# Altium project Master.PrjPCB
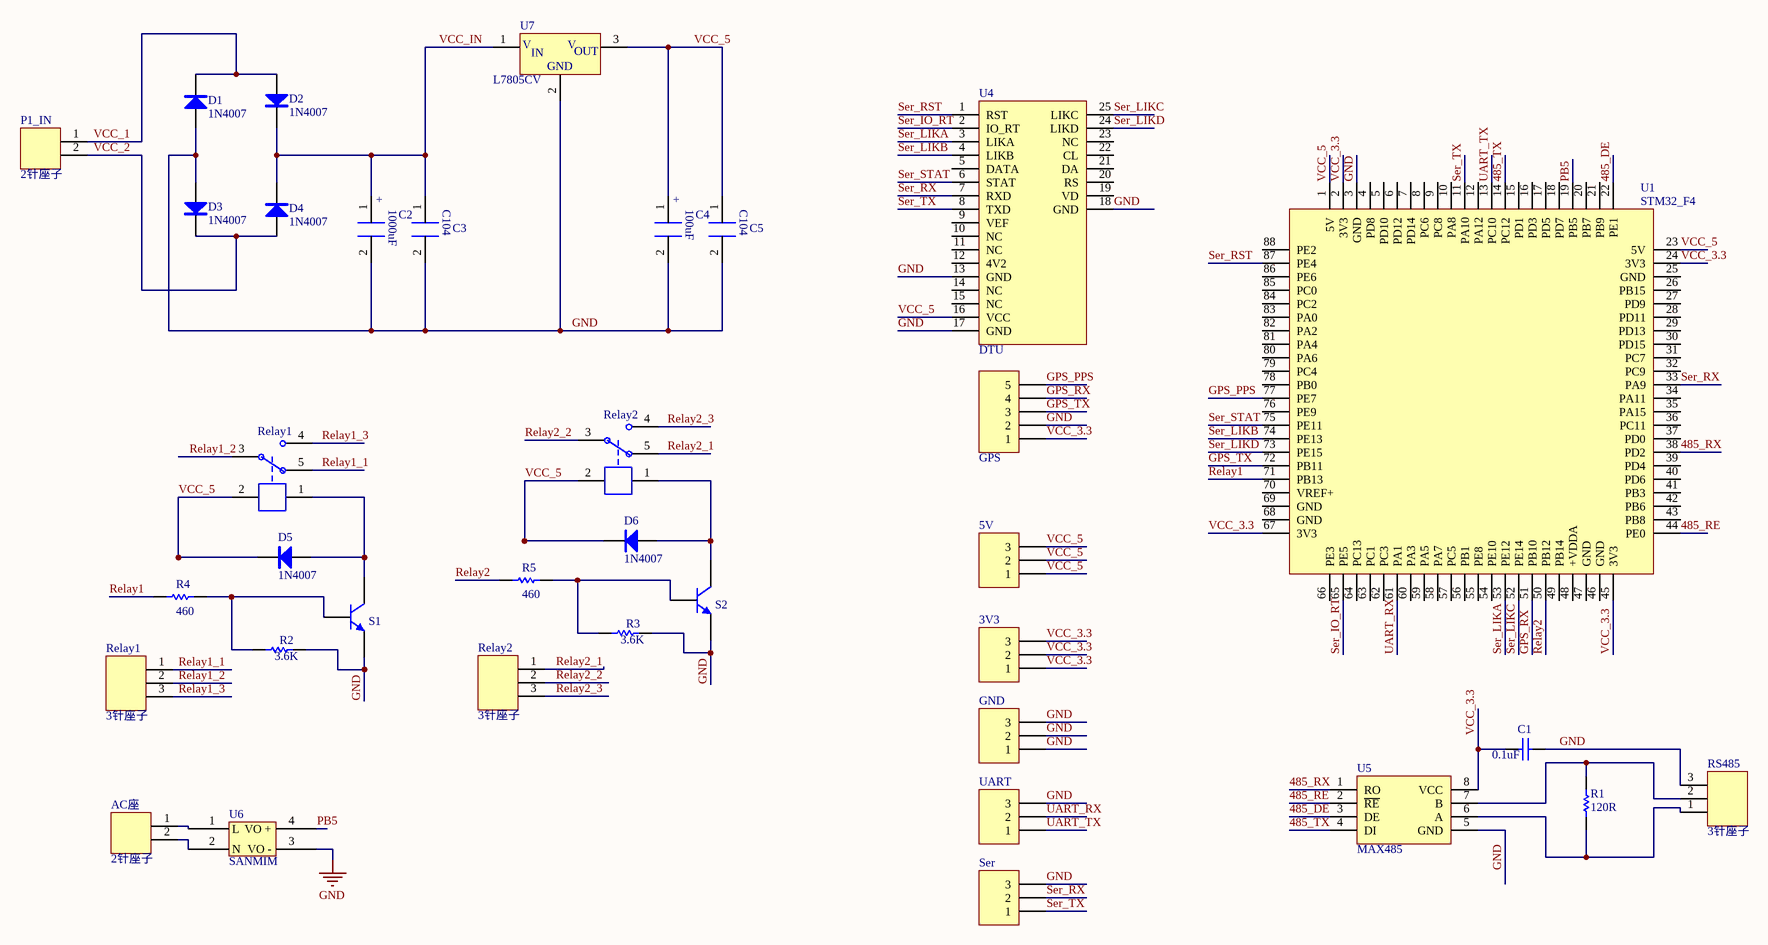
[diagram p0: Master_Sch.SchDoc]
1 sheet, 36 parts. Net scope: global (net labels, ports and power ports of the same name join across sheets).
Board file: Master_Pcb.PcbDoc

## Sheet Master_Sch.SchDoc
size A3; Organization: Altium Limited; Address1: L3, 12a Rodborough Rd; Address2: Frenchs Forest; Address3: NSW; Address4: Australia 2086

### Parts
(Parts that share a designator on the sheet are numbered #1, #2 ... from top to bottom, then left to right.)
3V3  Header 3  [HDR1X3]  (value not drawn)
5V  Header 3  [HDR1X3]  (value not drawn)
AC座  2针座子  [2针座子]
C1  value 0.1uF  [C2012]  (hidden comment: Cap)
C2  Cap1000uF  [Cap1000uF]  (value not drawn)
C3  Cap104  [Cap104]  (value not drawn)
C4  Cap100uF  [Cap100uF]  (value not drawn)
C5  Cap104  [Cap104]  (value not drawn)
D1  1N4007  [1N4007]
D2  1N4007  [1N4007]
D3  1N4007  [1N4007]
D4  1N4007  [1N4007]
D5  1N4007  [1N4007]
D6  1N4007  [1N4007]
GND  Header 3  [HDR1X3]  (value not drawn)
GPS  Header 5  [HDR1X5]  (value not drawn)
P1_IN  2针座子  [2针座子]
R1  value 120R  [R2012]  (hidden comment: Res)
R2  value 3.6K  [AXIAL-0.3]  (hidden comment: Res1)
R3  value 3.6K  [AXIAL-0.3]  (hidden comment: Res1)
R4  value 460  [AXIAL-0.3]  (hidden comment: Res1)
R5  value 460  [AXIAL-0.3]  (hidden comment: Res1)
Relay1#1  Relay_single  [Relay_single]  (value not drawn)
Relay1#2  3针座子  [3针座子]
Relay2#1  Relay_single  [Relay_single]  (value not drawn)
Relay2#2  3针座子  [3针座子]
RS485  3针座子  [3针座子]
S1  S9013_NPN  [S9013_NPN]  (value not drawn)
S2  S9013_NPN  [S9013_NPN]  (value not drawn)
Ser  Header 3  [HDR1X3]  (value not drawn)
U1  STM32_F4  [STM32_F4]
U4  DTU  [DTU]
U5  MAX485  [SOP8]
U6  SANMIM  [2针宽座子]
U7  L7805CV  [L7805CV]
UART  Header 3  [HDR1X3]  (value not drawn)

### Nets
GND: C1.2 C2.2 C3.2 C4.2 C5.2 D1.1(A) D3.1(A) GND.1 GND.2 GND.3 GPS.2 R2.2 R3.2 RS485.3 S1.3(C) S2.3(C) Ser.3 U1.3(GND) U4.13(GND) U4.17(GND) U4.18(GND) U5.5(GND) U6.3(VO_-) U7.2(GND) UART.3
485_DE: U1.22(PE1) U5.3(DE)
485_RE: U1.44(PE0) U5.2(~{RE})
485_RX: U1.38(PD2) U5.1(RO)
485_TX: U1.14(PC12) U5.4(DI)
GPS_PPS: GPS.5 U1.77(PE7)
GPS_RX: GPS.4 U1.51(PB10)
GPS_TX: GPS.3 U1.72(PB11)
PB5: U1.19(PB5) U6.4(VO_+)
Relay1: R4.1 U1.71(PB13)
Relay1_1: Relay1#1.5 Relay1#2.1
Relay1_2: Relay1#1.3 Relay1#2.2
Relay1_3: Relay1#1.4 Relay1#2.3
Relay2: R5.1 U1.50(PB12)
Relay2_1: Relay2#1.5 Relay2#2.1
Relay2_2: Relay2#1.3 Relay2#2.2
Relay2_3: Relay2#1.4 Relay2#2.3
Ser_IO_RT: U1.65(PE5) U4.2(IO_RT)
Ser_LIKA: U1.53(PE12) U4.3(LIKA)
Ser_LIKB: U1.74(PE13) U4.4(LIKB)
Ser_LIKC: U1.52(PE14) U4.25(LIKC)
Ser_LIKD: U1.73(PE15) U4.24(LIKD)
Ser_RST: U1.87(PE4) U4.1(RST)
Ser_RX: Ser.2 U1.33(PA9) U4.7(RXD)
Ser_STAT: U1.75(PE11) U4.6(STAT)
Ser_TX: Ser.1 U1.11(PA10) U4.8(TXD)
UART_RX: U1.61(PA1) UART.2
UART_TX: U1.13(PC10) UART.1
VCC_1: D1.2(K) D2.1(A) P1_IN.1
VCC_2: D3.2(K) D4.1(A) P1_IN.2
VCC_3.3: 3V3.1 3V3.2 3V3.3 C1.1 GPS.1 U1.2(3V3) U1.24(3V3) U1.45(3V3) U1.67(3V3) U5.8(VCC)
VCC_5: 5V.1 5V.2 5V.3 C4.1 C5.1 D5.2(K) D6.2(K) Relay1#1.2 Relay2#1.2 U1.1(5V) U1.23(5V) U4.16(VCC) U7.3(VOUT)
VCC_IN: C2.1 C3.1 D2.2(K) D4.2(K) U7.1(VIN)
NetAC座_1: AC座.1 U6.1(L)
NetAC座_2: AC座.2 U6.2(N)
NetD5_1: D5.1(A) Relay1#1.1 S1.1(E)
NetD6_1: D6.1(A) Relay2#1.1 S2.1(E)
NetR1_1: R1.1 RS485.1 U5.6(A)
NetR1_2: R1.2 RS485.2 U5.7(B)
NetR2_1: R2.1 R4.2 S1.2(B)
NetR3_1: R3.1 R5.2 S2.2(B)

Not connected (* = marked no-connect by the designer): U1 4(PD8) 5(PD10) 6(PD12) 7(PD14) 8(PC6) 9(PC8) 10(PA8) 12(PA12) 15(PD1) 16(PD3) 17(PD5) 18(PD7) 20(PB7) 21(PB9) 25(GND) 26(PB15) 27(PD9) 28(PD11) 29(PD13) 30(PD15) 31(PC7) 32(PC9) 34(PA11) 35(PA15) 36(PC11) 37(PD0) 39(PD4) 40(PD6) 41(PB3) 42(PB6) 43(PB8) 46(GND) 47(GND) 48(+VDDA) 49(PB14) 54(PE10) 55(PE8) 56(PB1) 57(PC5) 58(PA7) 59(PA5) 60(PA3) 62(PC3) 63(PC1) 64(PC13) 66(PE3) 68(GND) 69(GND) 70(VREF+) 76(PE9) 78(PB0) 79(PC4) 80(PA6) 81(PA4) 82(PA2) 83(PA0) 84(PC2) 85(PC0) 86(PE6) 88(PE2); U4 5(DATA) 9(VEF) 10(NC) 11(NC) 12(4V2) 14(NC) 15(NC) 19(VD) 20(RS) 21(DA) 22(CL) 23(NC)

### Notes on the sheet
- Title
- Size:
- Date:
- A4
- Number:
- Time:
- Revision:
- Sheet
- of
- File:
- (in symbol Cap100uF) +; 100uF
- (in symbol Cap104) C104
- (in symbol Cap1000uF) +; 1000uF
- (in symbol L7805CV) V; IN; OUT

### Library data of the parts
3V3 5V GND Ser UART = Header 3: Header, 3-Pin; LatestRevisionDate: 17-Jul-2002; LatestRevisionNote: Re-released for DXP Platform.; Publisher: Altium Limited
C1 = Cap: 贴片电容; Published: 8-Jun-2000; LatestRevisionDate: 17-Jul-2002; LatestRevisionNote: Re-released for DXP Platform.; PackageReference: RAD-0.3; Publisher: Altium Limited
GPS = Header 5: Header, 5-Pin; LatestRevisionDate: 17-Jul-2002; LatestRevisionNote: Re-released for DXP Platform.; Publisher: Altium Limited
R1 = Res: 贴片电阻; Published: 8-Jun-2000; LatestRevisionDate: 17-Jul-2002; LatestRevisionNote: Re-released for DXP Platform.; PackageReference: AXIAL-0.3; Publisher: Altium Limited
R2-R5 = Res1: Resistor; Published: 8-Jun-2000; LatestRevisionDate: 17-Jul-2002; LatestRevisionNote: Re-released for DXP Platform.; PackageReference: AXIAL-0.3; Publisher: Altium Limited; PackageDescription: Axial Device, Thru-Hole; 2 Leads; 0.3 in Pin Spacing